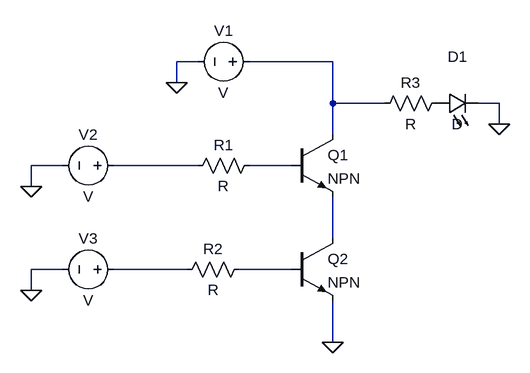
[diagram p0: schematic NAND_Gate.asc]
NAND_Gate.asc, the LTspice schematic file:
Version 4
SHEET 1 880 680
WIRE -64 16 -96 16
WIRE 144 16 16 16
WIRE -96 48 -96 16
WIRE 144 80 144 16
WIRE 224 80 144 80
WIRE 400 80 368 80
WIRE 400 112 400 80
WIRE 144 128 144 80
WIRE -272 176 -320 176
WIRE -64 176 -192 176
WIRE 80 176 16 176
WIRE -320 208 -320 176
WIRE 144 288 144 224
WIRE -272 336 -320 336
WIRE -80 336 -192 336
WIRE 80 336 0 336
WIRE -320 368 -320 336
WIRE 144 448 144 384
FLAG 144 448 0
FLAG -96 48 0
FLAG 400 112 0
FLAG -320 208 0
FLAG -320 368 0
SYMBOL res 32 160 R90
WINDOW 0 0 56 VBottom 2
WINDOW 3 32 56 VTop 2
SYMATTR InstName R1
SYMBOL res 16 320 R90
WINDOW 0 0 56 VBottom 2
WINDOW 3 32 56 VTop 2
SYMATTR InstName R2
SYMBOL npn 80 128 R0
SYMATTR InstName Q1
SYMBOL npn 80 288 R0
SYMATTR InstName Q2
SYMBOL voltage 32 16 R90
WINDOW 0 -32 56 VBottom 2
WINDOW 3 32 56 VTop 2
SYMATTR InstName V1
SYMBOL res 320 64 R90
WINDOW 0 0 56 VBottom 2
WINDOW 3 32 56 VTop 2
SYMATTR InstName R3
SYMBOL LED 304 96 R270
WINDOW 0 72 32 VTop 2
WINDOW 3 0 32 VBottom 2
SYMATTR InstName D1
SYMBOL voltage -176 176 R90
WINDOW 0 -32 56 VBottom 2
WINDOW 3 32 56 VTop 2
SYMATTR InstName V2
SYMBOL voltage -176 336 R90
WINDOW 0 -32 56 VBottom 2
WINDOW 3 32 56 VTop 2
SYMATTR InstName V3

The netlist it stands for:
* NAND_Gate.asc
R1 N003 N002 R
R2 N006 N005 R
Q1 N001 N003 N004 0 NPN
Q2 N004 N006 0 0 NPN
V1 N001 0 V
R3 P001 N001 R
D1 P001 0 D
V2 N002 0 V
V3 N005 0 V
.model D D
.lib standard.dio
.model NPN NPN
.model PNP PNP
.lib standard.bjt
.backanno
.end